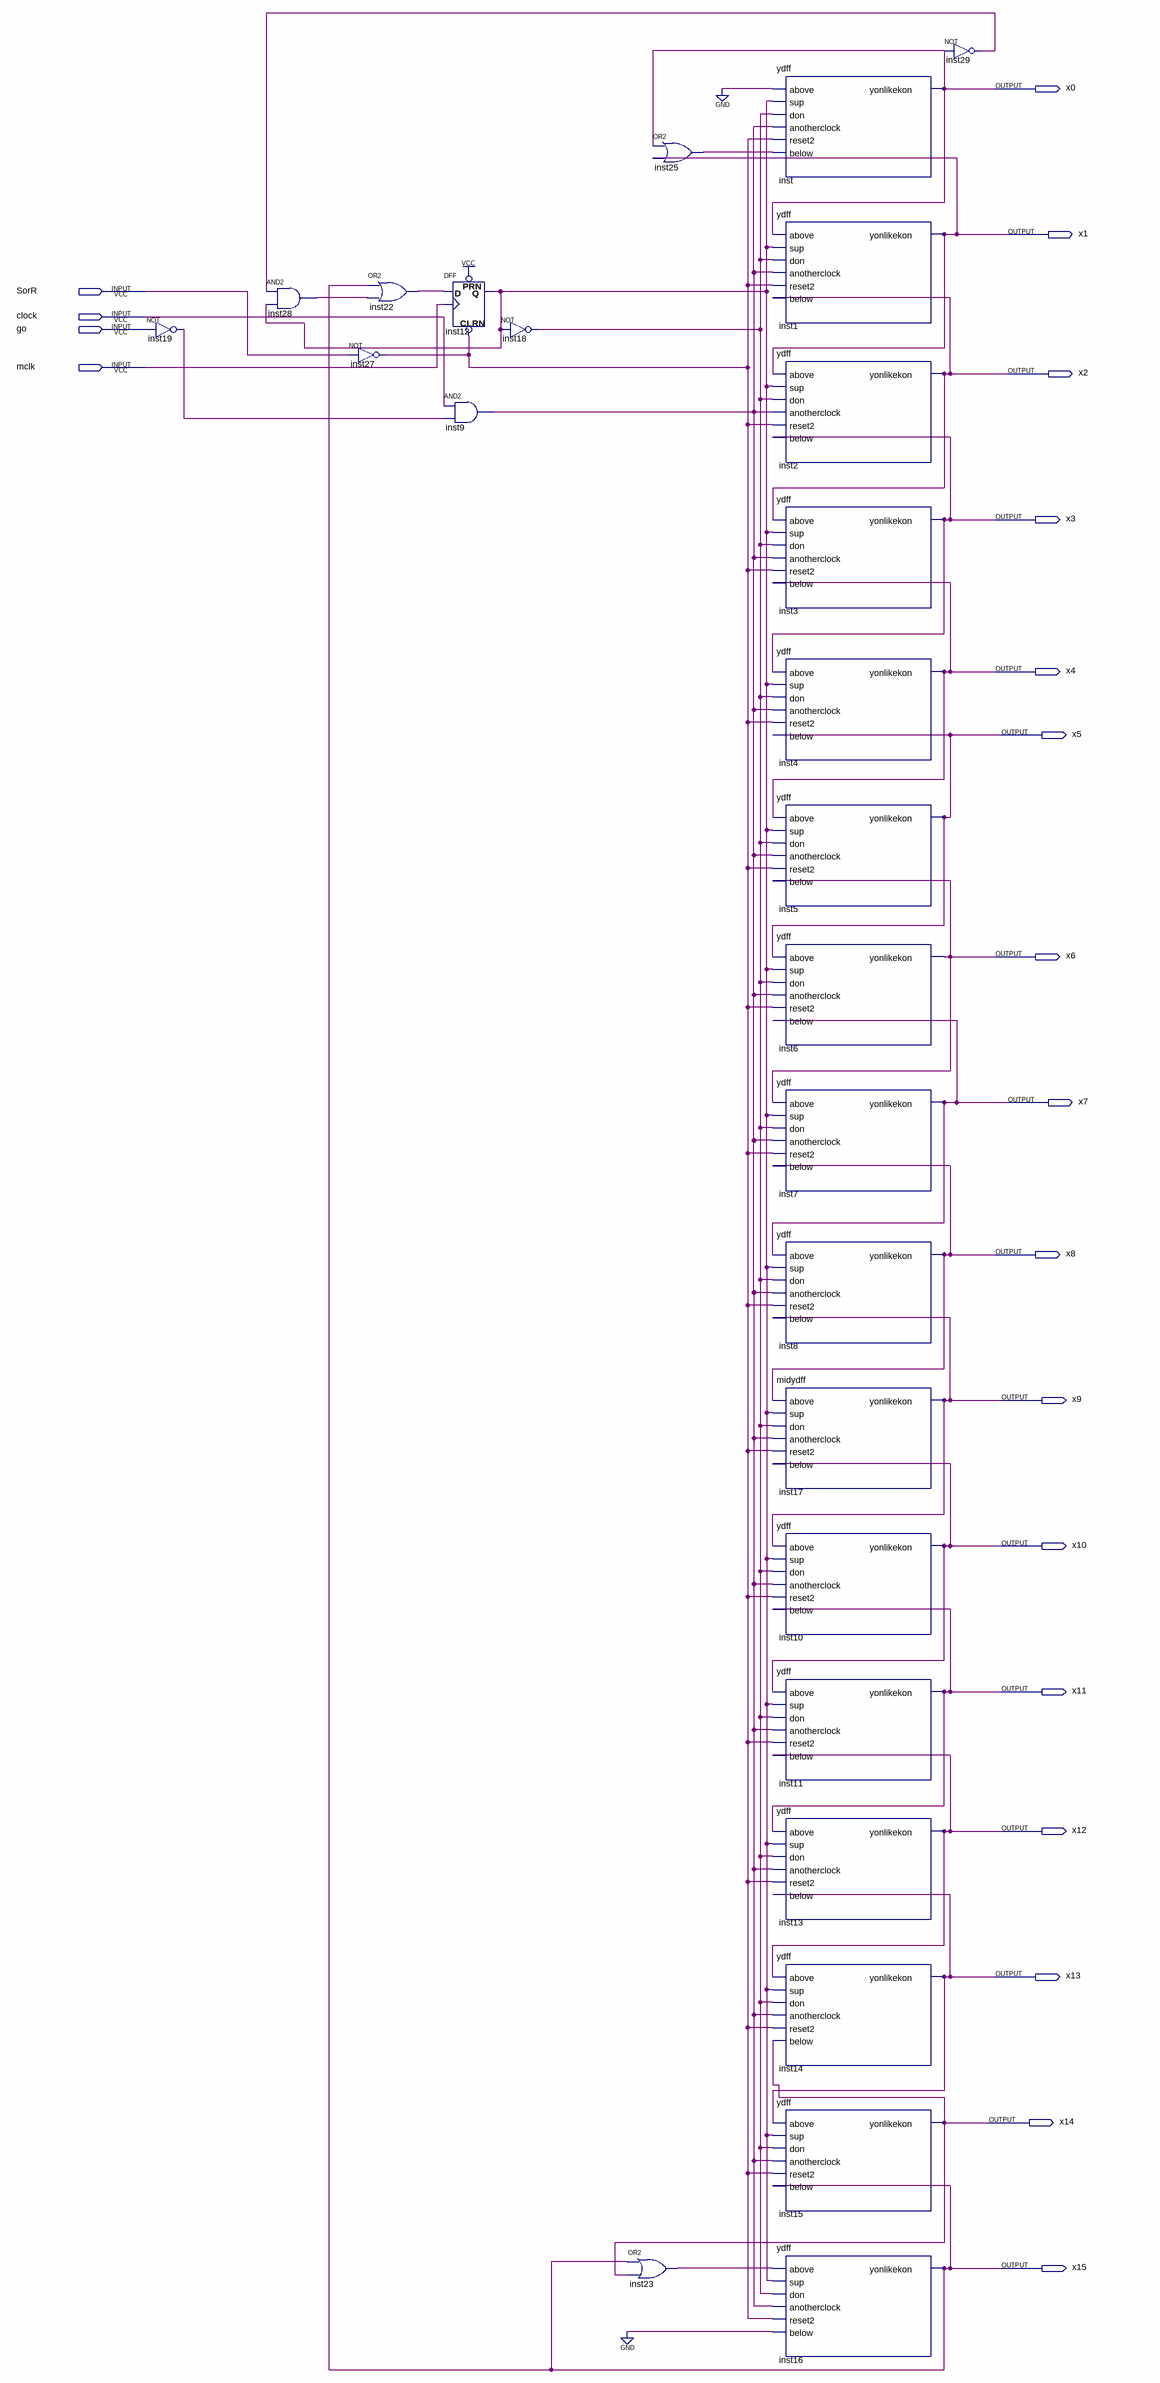
[diagram p0: schematic sheet]
// Quartus schematic xposnew.bdf as structural Verilog: 26 symbols, 20 pins
module xposnew (
  input  SorR,
  input  clock,
  input  go,
  input  mclk,
  output x0,
  output x1,
  output x2,
  output x3,
  output x4,
  output x5,
  output x6,
  output x7,
  output x8,
  output x9,
  output x10,
  output x11,
  output x12,
  output x13,
  output x14,
  output x15
);

  wire inst9_out, inst12_q, inst18_out, inst19_out, inst22_out, inst23_out, inst25_out, inst27_out,
       inst28_out, inst29_out;

  not inst19 (inst19_out, go);
  and inst28 (inst28_out, inst29_out, inst12_q);
  not inst27 (inst27_out, SorR);
  or inst22 (inst22_out, x15, inst28_out);
  DFF inst12 (.CLRN(inst27_out), .CLK(mclk), .D(inst22_out), .PRN(1'b1), .Q(inst12_q));
  and inst9 (inst9_out, clock, inst19_out);
  not inst18 (inst18_out, inst12_q);
  or inst25 (inst25_out, x0, x1);
  or inst23 (inst23_out, x15, x14);
  ydff inst (
    .above(1'b0), .sup(inst12_q), .don(inst18_out), .anotherclock(inst9_out), .reset2(inst27_out),
    .below(inst25_out), .yonlikekon(x0));
  ydff inst1 (
    .above(x0), .sup(inst12_q), .don(inst18_out), .anotherclock(inst9_out), .reset2(inst27_out), .below(x2),
    .yonlikekon(x1));
  ydff inst2 (
    .above(x1), .sup(inst12_q), .don(inst18_out), .anotherclock(inst9_out), .reset2(inst27_out), .below(x3),
    .yonlikekon(x2));
  ydff inst3 (
    .above(x2), .sup(inst12_q), .don(inst18_out), .anotherclock(inst9_out), .reset2(inst27_out), .below(x4),
    .yonlikekon(x3));
  ydff inst4 (
    .above(x3), .sup(inst12_q), .don(inst18_out), .anotherclock(inst9_out), .reset2(inst27_out), .below(x5),
    .yonlikekon(x4));
  ydff inst5 (
    .above(x4), .sup(inst12_q), .don(inst18_out), .anotherclock(inst9_out), .reset2(inst27_out), .below(x6),
    .yonlikekon(x5));
  ydff inst6 (
    .above(x5), .sup(inst12_q), .don(inst18_out), .anotherclock(inst9_out), .reset2(inst27_out), .below(x7),
    .yonlikekon(x6));
  ydff inst7 (
    .above(x6), .sup(inst12_q), .don(inst18_out), .anotherclock(inst9_out), .reset2(inst27_out), .below(x8),
    .yonlikekon(x7));
  ydff inst8 (
    .above(x7), .sup(inst12_q), .don(inst18_out), .anotherclock(inst9_out), .reset2(inst27_out), .below(x9),
    .yonlikekon(x8));
  midydff inst17 (
    .above(x8), .sup(inst12_q), .don(inst18_out), .anotherclock(inst9_out), .reset2(inst27_out), .below(x10),
    .yonlikekon(x9));
  ydff inst10 (
    .above(x9), .sup(inst12_q), .don(inst18_out), .anotherclock(inst9_out), .reset2(inst27_out), .below(x11),
    .yonlikekon(x10));
  ydff inst11 (
    .above(x10), .sup(inst12_q), .don(inst18_out), .anotherclock(inst9_out), .reset2(inst27_out),
    .below(x12), .yonlikekon(x11));
  ydff inst13 (
    .above(x11), .sup(inst12_q), .don(inst18_out), .anotherclock(inst9_out), .reset2(inst27_out),
    .below(x13), .yonlikekon(x12));
  ydff inst14 (
    .above(x12), .sup(inst12_q), .don(inst18_out), .anotherclock(inst9_out), .reset2(inst27_out),
    .below(x14), .yonlikekon(x13));
  ydff inst15 (
    .above(x13), .sup(inst12_q), .don(inst18_out), .anotherclock(inst9_out), .reset2(inst27_out),
    .below(x15), .yonlikekon(x14));
  ydff inst16 (
    .above(inst23_out), .sup(inst12_q), .don(inst18_out), .anotherclock(inst9_out), .reset2(inst27_out),
    .below(1'b0), .yonlikekon(x15));
  not inst29 (inst29_out, x0);
endmodule
